# EasyEDA Pro project ProPrj_超市储物柜控制系统_2026-04-29.epro

# Schematic Schematic1
Assembly Variant: Basic; Board Name: Board1; Create Date: 2026-04-28; Page Name: P1; Project Name: 超市储物柜控制系统; Schematic Name: Schematic1; Update Date: 2026-04-28; BladeWidth: 10; Company: 嘉立创EDA; Page Size: A4; RegionStart: 1; ShowBorder: 1; TitleBlock: 1; TitleBlockPosition: 3; Version: V1.0; XRegionCount: 6; YRegionCount: 4
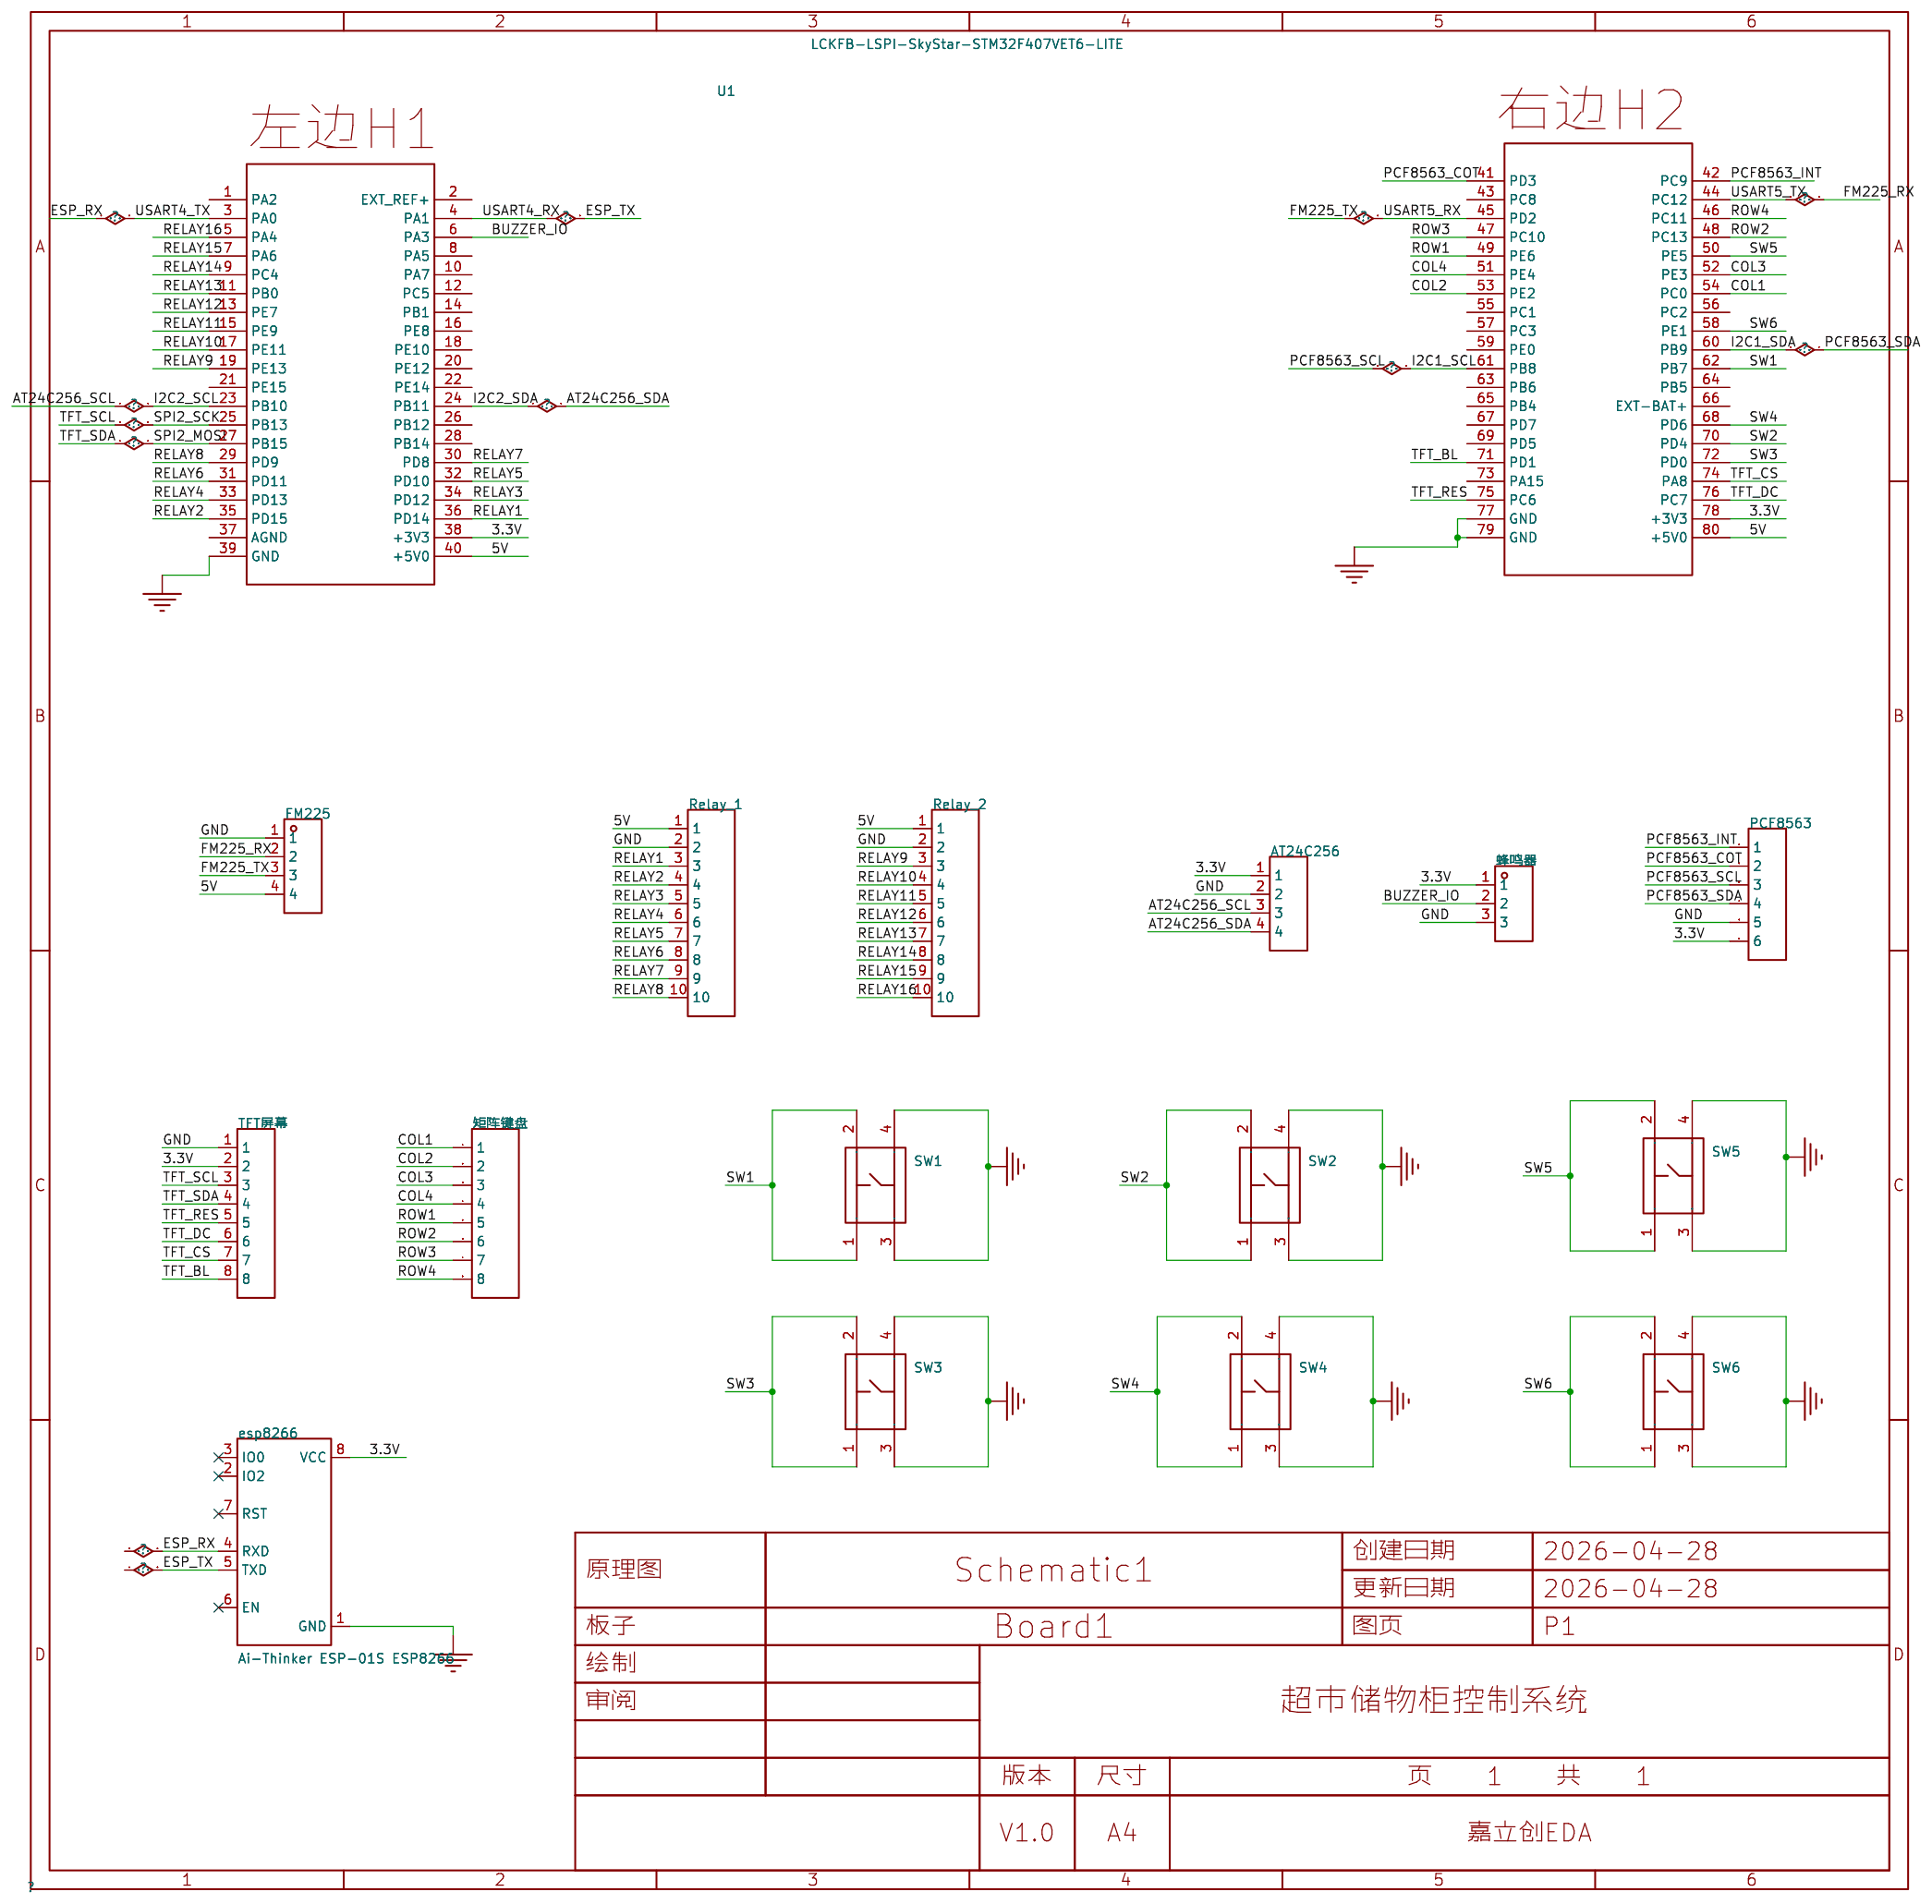
[diagram p0: schematic sheet]

## Parts
AT24C256  -  [HDR-TH_4P-P2.54-V-M]
esp8266  Ai-Thinker ESP-01S ESP8266  [WIFIM-TH_8P-L24.7-W14.4-P2.54]
FM225  -  [HDR-TH_4P-P2.54-V-F]
PCF8563  -  [HDR-TH_6P-P2.54-V-M-1]
Relay_1  -  [HDR-TH_10P-P2.54-V-M-1]
Relay_2  -  [HDR-TH_10P-P2.54-V-M-1]
SW1  K2-1102DP-C4SW-04  [KEY-TH_4P-L6.0-W6.0-P4.50-LS6.50]
SW2  K2-1102DP-C4SW-04  [KEY-TH_4P-L6.0-W6.0-P4.50-LS6.50]
SW3  K2-1102DP-C4SW-04  [KEY-TH_4P-L6.0-W6.0-P4.50-LS6.50]
SW4  K2-1102DP-C4SW-04  [KEY-TH_4P-L6.0-W6.0-P4.50-LS6.50]
SW5  K2-1102DP-C4SW-04  [KEY-TH_4P-L6.0-W6.0-P4.50-LS6.50]
SW6  K2-1102DP-C4SW-04  [KEY-TH_4P-L6.0-W6.0-P4.50-LS6.50]
TFT屏幕  -  [HDR-TH_8P-P2.54-V-F-1]
U1  LCKFB-LSPI-SkyStar-STM32F407VET6-LITE  [COMM-TH_LCKFB-LSPI-SKYSTAR-STM32F407VET6-LITE]
矩阵键盘  -  [HDR-TH_8P-P2.54-V-M]
蜂鸣器  -  [HDR-TH_3P-P2.54-V-M]

## Library data of the parts
AT24C256 = HDR-M_2.54_1x4P: Supplier Part: C492403; Supplier Footprint: 插件
esp8266 = Ai-Thinker ESP-01S ESP8266: Supplier Part: C17606792; Manufacturer: Ai-Thinker(安信可); JLCPCB Part Class: Extended Part; Datasheet: https://item.szlcsc.com/datasheet/Ai-Thinker%2520ESP-01S%2520ESP8266/18736031.html; Supplier: LCSC
FM225 = HDR-F_2.54_1x4P: Supplier Part: C2718488; Supplier Footprint: 插件
PCF8563 = HDR-M_2.54_1x6P: Supplier Part: C37208; Supplier Footprint: 插件
Relay_1 Relay_2 = HDR-M_2.54_1x10P: Supplier Part: C57369; Supplier Footprint: 插件
SW1-SW6 = K2-1102DP-C4SW-04: 电路结构:单刀单掷;按钮形状:圆形按钮;作用力:2.5N;安装方式:直插;开关长度:6mm;开关宽度:6mm;开关高度:5mm;触点电流:50mA;额定电压:12V;带灯:-;工作寿命:10万次;; LCSC Part Name: 轻触按键开关6*6*5; Supplier Part: C110153; Manufacturer: 韩国韩荣; Supplier Footprint: 插件-4P,6x6mm; JLCPCB Part Class: Extended Part; Datasheet: https://item.szlcsc.com/datasheet/K2-1102DP-C4SW-04/111374.html; Supplier: LCSC; Circuit: 单刀单掷; Actuator Style: 圆形按钮; Operating Force: 2.5N; Mounting Type: 直插; Length: 6mm; Width: 6mm; Switch Height: 5mm; Contact Current: 50mA; Voltage Rating: 12V; Life: 10万次; Operating Temperature: -25℃~+85℃
TFT屏幕 = HDR-F_2.54_1x8P: Supplier Part: C27438; Supplier Footprint: 插件
U1 = LCKFB-LSPI-SkyStar-STM32F407VET6-LITE: 单板,不送排针; LCSC Part Name: 立创·天空星开发板-STM32F407VET6-青春版; Supplier Part: C22370035; Manufacturer: 立创开发板; JLCPCB Part Class: Extended Part; Datasheet: https://item.szlcsc.com/datasheet/LCKFB-LSPI-SkyStar-STM32F407VET6-LITE/23849165.html; Supplier: LCSC
矩阵键盘 = HDR-M_2.54_1x8P: Supplier Part: C124381; Supplier Footprint: 插件
蜂鸣器 = HDR-M_2.54_1x3P: Supplier Part: C2937625; Supplier Footprint: 插件

## Nets
3.3V: AT24C256.1 esp8266.8(VCC) PCF8563.6 TFT屏幕.2 U1.38(+3V3) U1.78(+3V3) 蜂鸣器.1
5V: FM225.4 Relay_1.1 Relay_2.1 U1.40(+5V0) U1.80(+5V0)
GND: AT24C256.2 esp8266.1(GND) FM225.1 PCF8563.5 Relay_1.2 Relay_2.2 SW1.3 SW1.4 SW2.3 SW2.4 SW3.3 SW3.4 SW4.3 SW4.4 SW5.3 SW5.4 SW6.3 SW6.4 TFT屏幕.1 U1.39(GND) U1.77(GND) U1.79(GND) 蜂鸣器.3
AT24C256_SCL: AT24C256.3 U1.23(PB10)
AT24C256_SDA: AT24C256.4 U1.24(PB11)
BUZZER_IO: U1.6(PA3) 蜂鸣器.2
COL1: U1.54(PC0) 矩阵键盘.1
COL2: U1.53(PE2) 矩阵键盘.2
COL3: U1.52(PE3) 矩阵键盘.3
COL4: U1.51(PE4) 矩阵键盘.4
ESP_RX: esp8266.4(RXD) U1.3(PA0)
ESP_TX: esp8266.5(TXD) U1.4(PA1)
FM225_RX: FM225.2 U1.44(PC12)
FM225_TX: FM225.3 U1.45(PD2)
I2C1_SCL: PCF8563.3 U1.61(PB8)
I2C1_SDA: PCF8563.4 U1.60(PB9)
PCF8563_COT: PCF8563.2 U1.41(PD3)
PCF8563_INT: PCF8563.1 U1.42(PC9)
RELAY1: Relay_1.3 U1.36(PD14)
RELAY2: Relay_1.4 U1.35(PD15)
RELAY3: Relay_1.5 U1.34(PD12)
RELAY4: Relay_1.6 U1.33(PD13)
RELAY5: Relay_1.7 U1.32(PD10)
RELAY6: Relay_1.8 U1.31(PD11)
RELAY7: Relay_1.9 U1.30(PD8)
RELAY8: Relay_1.10 U1.29(PD9)
RELAY9: Relay_2.3 U1.19(PE13)
RELAY10: Relay_2.4 U1.17(PE11)
RELAY11: Relay_2.5 U1.15(PE9)
RELAY12: Relay_2.6 U1.13(PE7)
RELAY13: Relay_2.7 U1.11(PB0)
RELAY14: Relay_2.8 U1.9(PC4)
RELAY15: Relay_2.9 U1.7(PA6)
RELAY16: Relay_2.10 U1.5(PA4)
ROW1: U1.49(PE6) 矩阵键盘.5
ROW2: U1.48(PC13) 矩阵键盘.6
ROW3: U1.47(PC10) 矩阵键盘.7
ROW4: U1.46(PC11) 矩阵键盘.8
SPI2_MOSI: TFT屏幕.4 U1.27(PB15)
SPI2_SCK: TFT屏幕.3 U1.25(PB13)
SW1: SW1.1 SW1.2 U1.62(PB7)
SW2: SW2.1 SW2.2 U1.70(PD4)
SW3: SW3.1 SW3.2 U1.72(PD0)
SW4: SW4.1 SW4.2 U1.68(PD6)
SW5: SW5.1 SW5.2 U1.50(PE5)
SW6: SW6.1 SW6.2 U1.58(PE1)
TFT_BL: TFT屏幕.8 U1.71(PD1)
TFT_CS: TFT屏幕.7 U1.74(PA8)
TFT_DC: TFT屏幕.6 U1.76(PC7)
TFT_RES: TFT屏幕.5 U1.75(PC6)

Not connected (* = marked no-connect by the designer): esp8266 2(IO2)* 3(IO0)* 6(EN)* 7(RST)*; U1 1(PA2) 2(EXT REF+) 8(PA5) 10(PA7) 12(PC5) 14(PB1) 16(PE8) 18(PE10) 20(PE12) 21(PE15) 22(PE14) 26(PB12) 28(PB14) 37(AGND) 43(PC8) 55(PC1) 56(PC2) 57(PC3) 59(PE0) 63(PB6) 64(PB5) 65(PB4) 66(EXT-BAT+) 67(PD7) 69(PD5) 73(PA15)

# Board PCB1
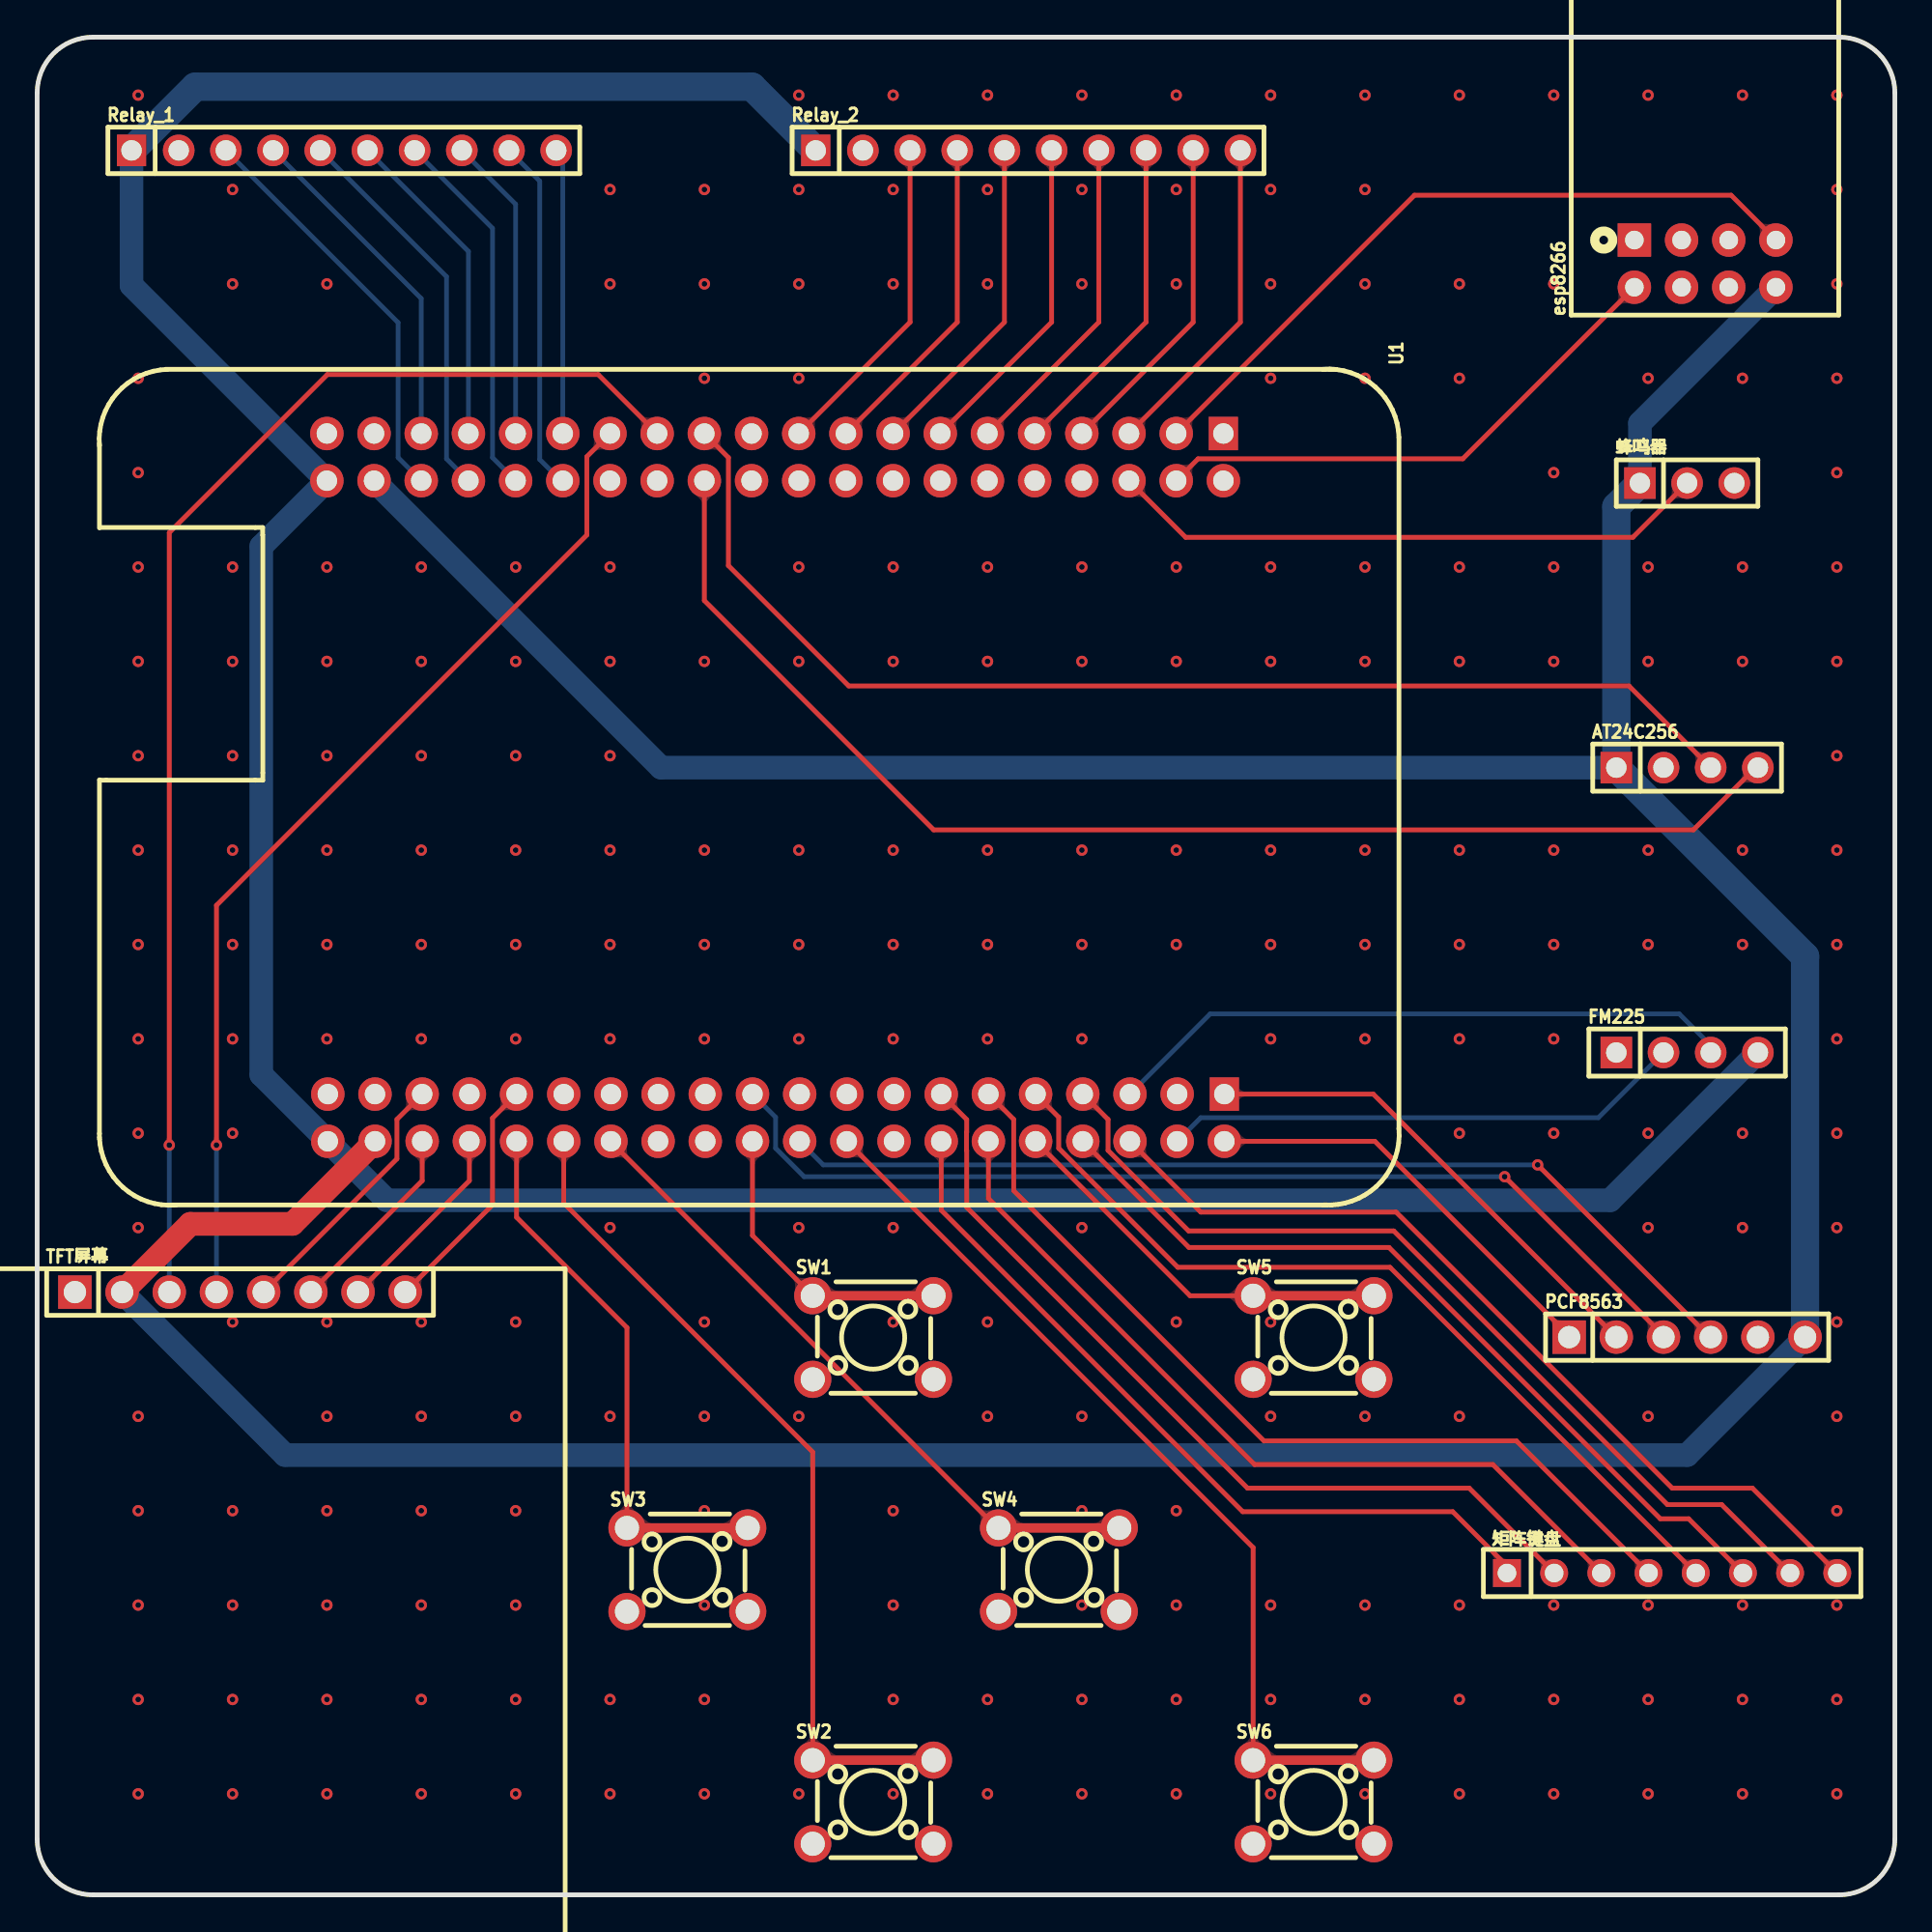
[diagram p1: board, top side]
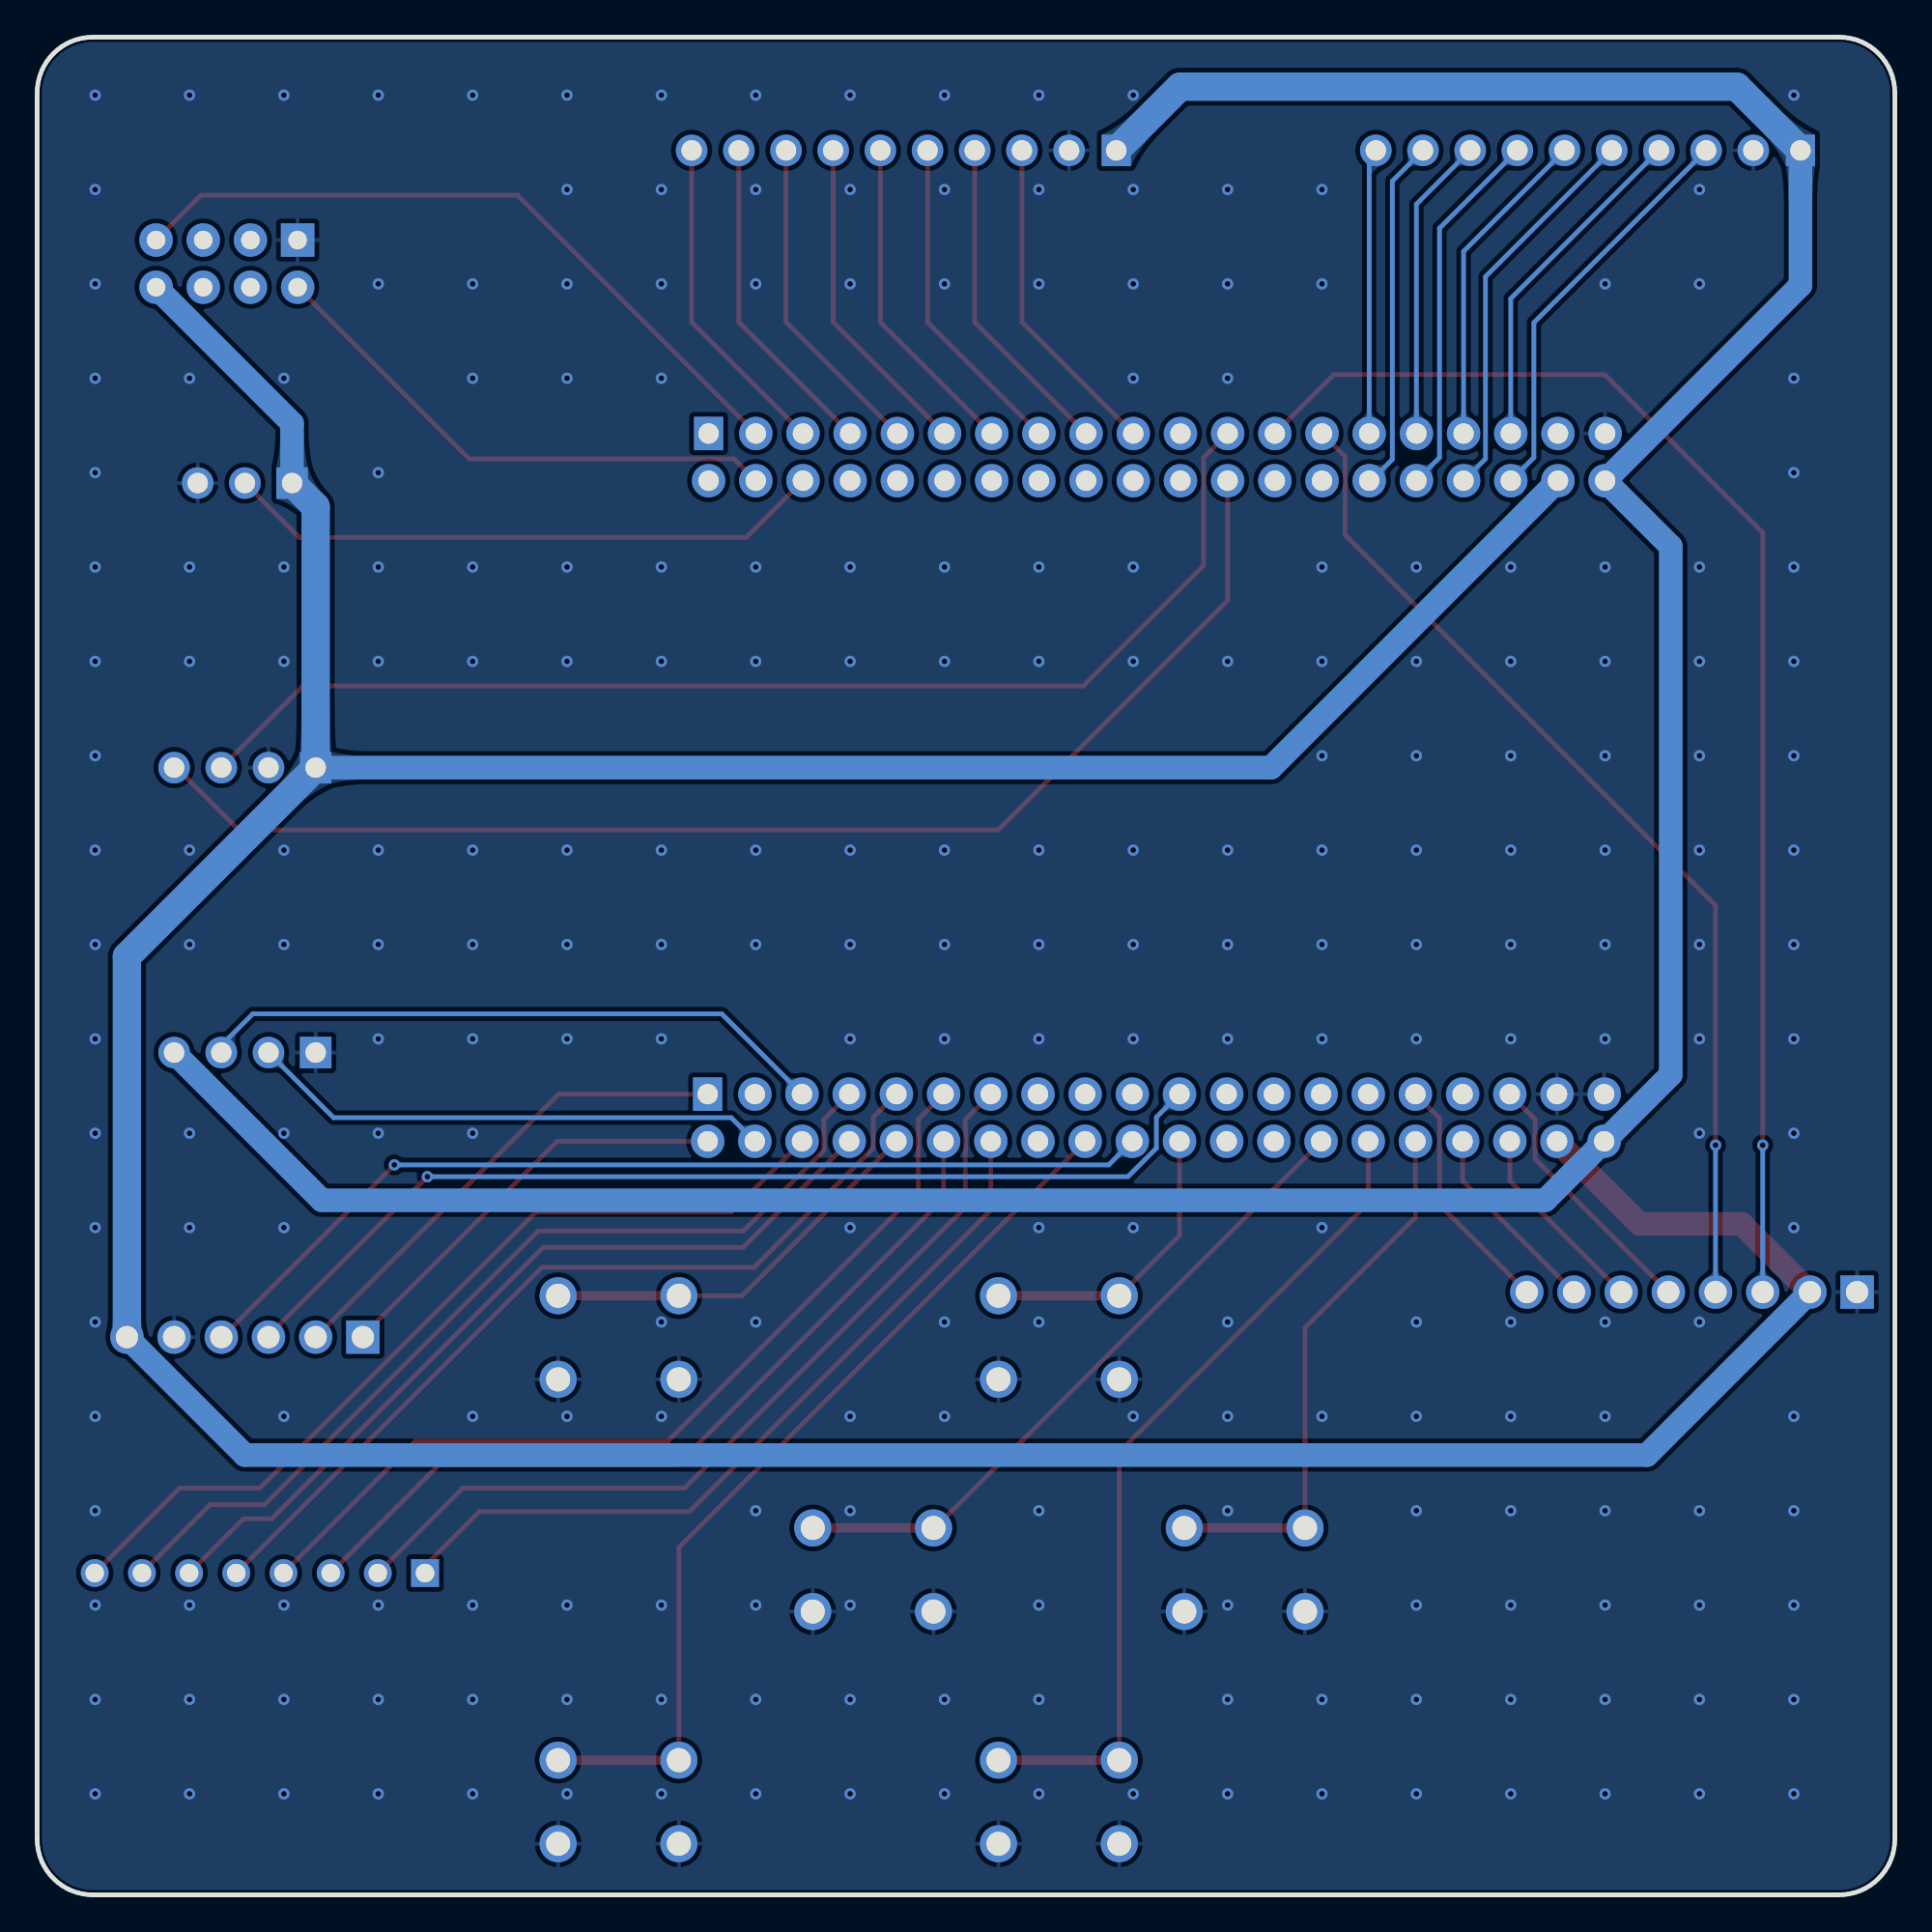
[diagram p2: board, bottom side, seen from below]

Outline 100 x 100 mm; copper layers: Top Layer, Bottom Layer. Coordinates in mm from the lower left corner of the outline.
Outline path: 0,97 0,3 arc(0.88,0.88) 3,0 97,0 arc(99.12,0.88) 100,3 100,97 arc(99.12,99.12) 97,100 3,100 arc(0.88,99.12) 0,97
Stack: Top Layer 0.035mm / Dielectric1 1.51mm FR4 er 4.5 / Bottom Layer 0.035mm

## Design rules (mm)
spacing copperThickness1oz (default): track to track 0.102, other pairs 0.152 to 0.3
spacing copperThickness2oz: track to track 0.203, other pairs 0.152 to 0.3
track width copperThickness1oz (default): min 0.127, default 0.254, max 2.54
track width copperThickness2oz: min 0.203, default 0.254, max 2.54
differential pair differentialPair (default): width min 0.127, default 0.254, max 2.54; gap min 0.152, default 0.152
net GND uses copperRegion

## Placement (name value [footprint] x y rotation side)
AT24C256  -  [HDR-TH_4P-P2.54-V-M]  88.82 60.68 0 top
esp8266  Ai-Thinker ESP-01S ESP8266  [WIFIM-TH_8P-L24.7-W14.4-P2.54]  89.79 87.81 90 top
FM225  -  [HDR-TH_4P-P2.54-V-F]  88.82 45.34 0 top
PCF8563  -  [HDR-TH_6P-P2.54-V-M-1]  88.82 30.02 0 top
Relay_1  -  [HDR-TH_10P-P2.54-V-M-1]  16.51 93.9 0 top
Relay_2  -  [HDR-TH_10P-P2.54-V-M-1]  53.34 93.9 0 top
SW1  K2-1102DP-C4SW-04  [KEY-TH_4P-L6.0-W6.0-P4.50-LS6.50]  45 30 0 top
SW2  K2-1102DP-C4SW-04  [KEY-TH_4P-L6.0-W6.0-P4.50-LS6.50]  45 5 0 top
SW3  K2-1102DP-C4SW-04  [KEY-TH_4P-L6.0-W6.0-P4.50-LS6.50]  35 17.5 0 top
SW4  K2-1102DP-C4SW-04  [KEY-TH_4P-L6.0-W6.0-P4.50-LS6.50]  55 17.5 0 top
SW5  K2-1102DP-C4SW-04  [KEY-TH_4P-L6.0-W6.0-P4.50-LS6.50]  68.71 30 0 top
SW6  K2-1102DP-C4SW-04  [KEY-TH_4P-L6.0-W6.0-P4.50-LS6.50]  68.71 5 0 top
TFT屏幕  -  [HDR-TH_8P-P2.54-V-F-1]  10.92 32.45 0 top
U1  LCKFB-LSPI-SkyStar-STM32F407VET6-LITE  [COMM-TH_LCKFB-LSPI-SKYSTAR-STM32F407VET6-LITE]  39.75 59.61 270 top
矩阵键盘  -  [HDR-TH_8P-P2.54-V-M]  88.01 17.32 0 top
蜂鸣器  -  [HDR-TH_3P-P2.54-V-M]  88.82 76 0 top

## Footprints (pads in the part's own frame, mm; a bottom-side part is the same pattern mirrored in y, then rotated)
COMM-TH_LCKFB-LSPI-SKYSTAR-STM32F407VET6-LITE
  rect 1.8x1.575 hole 1.1: 1(-19.05,24.105) 41(16.51,24.155)
  round 1.8 hole 1.1: 2(-16.51,24.105) 3(-19.05,21.564) 4(-16.51,21.564) 5(-19.05,19.024) 6(-16.51,19.024) 7(-19.05,16.485) 8(-16.51,16.485) 9(-19.05,13.944) 10(-16.51,13.944) 11(-19.05,11.405) 12(-16.51,11.405) 13(-19.05,8.864) 14(-16.51,8.864) 15(-19.05,6.324) 16(-16.51,6.324) 17(-19.05,3.784) 18(-16.51,3.784) 19(-19.05,1.244) 20(-16.51,1.244) 21(-19.05,-1.296) 22(-16.51,-1.296) 23(-19.05,-3.836) 24(-16.51,-3.836) 25(-19.05,-6.375) 26(-16.51,-6.375) 27(-19.05,-8.915) 28(-16.51,-8.915) 29(-19.05,-11.456) 30(-16.51,-11.456) 31(-19.05,-13.995) 32(-16.51,-13.995) 33(-19.05,-16.535) 34(-16.51,-16.535) 35(-19.05,-19.076) 36(-16.51,-19.076) 37(-19.05,-21.616) 38(-16.51,-21.616) 39(-19.05,-24.155) 40(-16.51,-24.155) 42(19.05,24.155) 43(16.51,21.616) 44(19.05,21.616) 45(16.51,19.076) 46(19.05,19.076) 47(16.51,16.535) 48(19.05,16.535) 49(16.51,13.995) 50(19.05,13.995) 51(16.51,11.456) 52(19.05,11.456) 53(16.51,8.915) 54(19.05,8.915) 55(16.51,6.375) 56(19.05,6.375) 57(16.51,3.836) 58(19.05,3.836) 59(16.51,1.296) 60(19.05,1.296) 61(16.51,-1.244) 62(19.05,-1.244) 63(16.51,-3.784) 64(19.05,-3.784) 65(16.51,-6.324) 66(19.05,-6.324) 67(16.51,-8.864) 68(19.05,-8.864) 69(16.51,-11.405) 70(19.05,-11.405) 71(16.51,-13.944) 72(19.05,-13.944) 73(16.51,-16.485) 74(19.05,-16.485) 75(16.51,-19.024) 76(19.05,-19.024) 77(16.51,-21.564) 78(19.05,-21.564) 79(16.51,-24.105) 80(19.05,-24.105)
HDR-TH_3P-P2.54-V-M
  rect 1.7x1.7 hole 1.1: 1(-2.54,0)
  round 1.7 hole 1.1: 2(0,0) 3(2.54,0)
HDR-TH_4P-P2.54-V-F
  rect 1.7x1.7 hole 1.1: 1(-3.81,0)
  round 1.7 hole 1.1: 2(-1.27,0) 3(1.27,0) 4(3.81,0)
HDR-TH_4P-P2.54-V-M
  rect 1.7x1.7 hole 1.1: 1(-3.81,0)
  round 1.7 hole 1.1: 2(-1.27,0) 3(1.27,0) 4(3.81,0)
HDR-TH_6P-P2.54-V-M-1
  rect 1.8x1.8 hole 1.2: 1(-6.35,0)
  round 1.8 hole 1.2: 2(-3.81,0) 3(-1.27,0) 4(1.27,0) 5(3.81,0) 6(6.35,0)
HDR-TH_8P-P2.54-V-F-1
  rect 1.8x1.8 hole 1.2: 1(-8.89,0)
  round 1.8 hole 1.2: 2(-6.35,0) 3(-3.81,0) 4(-1.27,0) 5(1.27,0) 6(3.81,0) 7(6.35,0) 8(8.89,0)
HDR-TH_8P-P2.54-V-M
  rect 1.5x1.5 hole 1: 1(-8.89,0)
  round 1.5 hole 1: 2(-6.35,0) 3(-3.81,0) 4(-1.27,0) 5(1.27,0) 6(3.81,0) 7(6.35,0) 8(8.89,0)
HDR-TH_10P-P2.54-V-M-1
  rect 1.575x1.7 hole 1.1: 1(-11.43,0)
  round 1.7 hole 1.1: 2(-8.89,0) 3(-6.35,0) 4(-3.81,0) 5(-1.27,0) 6(1.27,0) 7(3.81,0) 8(6.35,0) 9(8.89,0) 10(11.43,0)
KEY-TH_4P-L6.0-W6.0-P4.50-LS6.50
  round 2 hole 1.3: 1(-3.25,2.25) 2(3.25,2.25) 3(-3.25,-2.25) 4(3.25,-2.25)
WIFIM-TH_8P-L24.7-W14.4-P2.54
  rect 1.8x1.8 hole 1: 1(1.27,3.81)
  round 1.8 hole 1: 2(1.27,1.27) 3(1.27,-1.27) 4(1.27,-3.81) 5(-1.27,3.81) 6(-1.27,1.27) 7(-1.27,-1.27) 8(-1.27,-3.81)

## Nets
As in the schematic.

Pads without a net: esp8266 2 3 6 7; U1 1 2 8 10 12 14 16 18 20 21 22 26 28 37 43 55 56 57 59 63 64 65 66 67 69 73

## Via types
v1: diameter 0.61, hole 0.305, Top Layer to Bottom Layer, 254 vias

## Routing (per net, layer and track width the routed paths; a pad name or vN(x,y) marks a point on that pad's centre or on a via; arc(x,y) is an arc through that point)
3.3V: length 251.4
  Top Layer w1.27: TFT屏幕.2 8.25,36.12 13.74,36.12 U1.78
  Bottom Layer w1.27: TFT屏幕.2 13.34,23.67 88.82,23.67 PCF8563.6 ; AT24C256.1 33.58,60.68 U1.38 ; esp8266.8 86.28,79.22 蜂鸣器.1
  Bottom Layer w1.524: 蜂鸣器.1 85.01,74.73 AT24C256.1 95.17,50.52 PCF8563.6
5V: length 181.9
  Bottom Layer w1.27: Relay_1.1 5.08,86.64 U1.40 12.06,72.59 12.06,44.15 U1.80 18.82,37.39 84.68,37.39 FM225.4
  Bottom Layer w1.524: Relay_2.1 38.48,97.33 8.51,97.33 Relay_1.1
GND:
  vias: v1(5.44,96.88) v1(5.44,81.64) v1(5.44,76.56) v1(5.44,71.48) v1(5.44,66.4) v1(5.44,61.32) v1(5.44,56.24) v1(5.44,51.16) v1(5.44,46.08) v1(5.44,41) v1(5.44,35.92) v1(5.44,25.76) v1(5.44,20.68) v1(5.44,15.6) v1(5.44,10.52) v1(5.44,5.44) v1(10.52,91.8) v1(10.52,86.72) v1(10.52,71.48) v1(10.52,66.4) v1(10.52,61.32) v1(10.52,56.24) v1(10.52,51.16) v1(10.52,46.08) v1(10.52,41) v1(10.52,30.84) v1(10.52,20.68) v1(10.52,15.6) v1(10.52,10.52) v1(10.52,5.44) v1(15.6,86.72) v1(15.6,71.48) v1(15.6,66.4) v1(15.6,61.32) v1(15.6,56.24) v1(15.6,51.16) v1(15.6,46.08) v1(15.6,30.84) v1(15.6,25.76) v1(15.6,20.68) v1(15.6,15.6) v1(15.6,10.52) v1(15.6,5.44) v1(20.68,71.48) v1(20.68,66.4) v1(20.68,61.32) v1(20.68,56.24) v1(20.68,51.16) v1(20.68,46.08) v1(20.68,30.84) v1(20.68,25.76) v1(20.68,20.68) v1(20.68,15.6) v1(20.68,10.52) v1(20.68,5.44) v1(25.76,71.48) v1(25.76,66.4) v1(25.76,61.32) v1(25.76,56.24) v1(25.76,51.16) v1(25.76,46.08) v1(25.76,30.84) v1(25.76,25.76) v1(25.76,20.68) v1(25.76,15.6) v1(25.76,10.52) v1(25.76,5.44) v1(30.84,91.8) v1(30.84,86.72) v1(30.84,71.48) v1(30.84,66.4) v1(30.84,61.32) v1(30.84,56.24) v1(30.84,51.16) v1(30.84,46.08) v1(30.84,35.92) v1(30.84,25.76) v1(30.84,10.52) v1(30.84,5.44) v1(35.92,91.8) v1(35.92,86.72) v1(35.92,81.64) v1(35.92,66.4) v1(35.92,56.24) v1(35.92,51.16) v1(35.92,46.08) v1(35.92,30.84) v1(35.92,25.76) v1(35.92,20.68) v1(35.92,15.6) v1(35.92,10.52) v1(35.92,5.44) v1(41,96.88) v1(41,91.8) v1(41,86.72) v1(41,81.64) v1(41,71.48) v1(41,66.4) v1(41,56.24) v1(41,51.16) v1(41,46.08) v1(41,35.92) v1(41,25.76) v1(41,5.44) v1(46.08,96.88) v1(46.08,91.8) v1(46.08,86.72) v1(46.08,71.48) v1(46.08,66.4) v1(46.08,56.24) v1(46.08,51.16) v1(46.08,46.08) v1(46.08,35.92) v1(46.08,30.84) v1(46.08,20.68) v1(46.08,15.6) v1(46.08,10.52) v1(46.08,5.44) v1(51.16,96.88) v1(51.16,91.8) v1(51.16,86.72) v1(51.16,71.48) v1(51.16,66.4) v1(51.16,56.24) v1(51.16,51.16) v1(51.16,46.08) v1(51.16,30.84) v1(51.16,25.76) v1(51.16,10.52) v1(51.16,5.44) v1(56.24,96.88) v1(56.24,91.8) v1(56.24,86.72) v1(56.24,71.48) v1(56.24,66.4) v1(56.24,56.24) v1(56.24,51.16) v1(56.24,46.08) v1(56.24,35.92) v1(56.24,25.76) v1(56.24,20.68) v1(56.24,15.6) v1(56.24,10.52) v1(56.24,5.44) v1(61.32,96.88) v1(61.32,91.8) v1(61.32,86.72) v1(61.32,71.48) v1(61.32,66.4) v1(61.32,56.24) v1(61.32,51.16) v1(61.32,30.84) v1(61.32,20.68) v1(61.32,15.6) v1(61.32,10.52) v1(61.32,5.44) v1(66.4,96.88) v1(66.4,91.8) v1(66.4,86.72) v1(66.4,81.64) v1(66.4,71.48) v1(66.4,66.4) v1(66.4,56.24) v1(66.4,51.16) v1(66.4,46.08) v1(66.4,30.84) v1(66.4,25.76) v1(66.4,15.6) v1(66.4,10.52) v1(66.4,5.44) v1(71.48,96.88) v1(71.48,91.8) v1(71.48,86.72) v1(71.48,81.64) v1(71.48,71.48) v1(71.48,66.4) v1(71.48,56.24) v1(71.48,51.16) v1(71.48,46.08) v1(71.48,25.76) v1(71.48,15.6) v1(71.48,10.52) v1(71.48,5.44) v1(76.56,96.88) v1(76.56,86.72) v1(76.56,81.64) v1(76.56,71.48) v1(76.56,66.4) v1(76.56,56.24) v1(76.56,51.16) v1(76.56,46.08) v1(76.56,41) v1(76.56,25.76) v1(76.56,15.6) v1(76.56,10.52) v1(76.56,5.44) v1(81.64,96.88) v1(81.64,86.72) v1(81.64,76.56) v1(81.64,71.48) v1(81.64,66.4) v1(81.64,56.24) v1(81.64,51.16) v1(81.64,46.08) v1(81.64,41) v1(81.64,15.6) v1(81.64,10.52) v1(81.64,5.44) v1(86.72,96.88) v1(86.72,81.64) v1(86.72,71.48) v1(86.72,66.4) v1(86.72,56.24) v1(86.72,51.16) v1(86.72,41) v1(86.72,35.92) v1(86.72,25.76) v1(86.72,15.6) v1(86.72,10.52) v1(86.72,5.44) v1(91.8,96.88) v1(91.8,81.64) v1(91.8,71.48) v1(91.8,66.4) v1(91.8,56.24) v1(91.8,51.16) v1(91.8,41) v1(91.8,35.92) v1(91.8,15.6) v1(91.8,10.52) v1(91.8,5.44) v1(96.88,96.88) v1(96.88,91.8) v1(96.88,86.72) v1(96.88,81.64) v1(96.88,76.56) v1(96.88,71.48) v1(96.88,66.4) v1(96.88,61.32) v1(96.88,56.24) v1(96.88,51.16) v1(96.88,46.08) v1(96.88,41) v1(96.88,35.92) v1(96.88,30.84) v1(96.88,25.76) v1(96.88,20.68) v1(96.88,15.6) v1(96.88,10.52) v1(96.88,5.44)
AT24C256_SCL: length 65
  Top Layer w0.254: AT24C256.3 85.69,65.08 43.69,65.08 37.21,71.55 37.21,77.37 U1.23
AT24C256_SDA: length 69.7
  Top Layer w0.254: U1.24 35.92,69.67 48.26,57.33 89.15,57.33 92.5,60.68 AT24C256.4
BUZZER_IO: length 32.5
  Top Layer w0.254: U1.6 61.82,73.08 85.9,73.08 蜂鸣器.2
COL1: length 42.5
  Top Layer w0.254: U1.54 48.67,36.86 64.9,20.62 76.2,20.62 79.12,17.7 矩阵键盘.1
COL2: length 46.4
  Top Layer w0.254: U1.53 50.04,41.73 50.04,41.06 50.03,41.05 50.03,40.08 50.04,40.06 50.04,37.01 65.15,21.9 77.09,21.9 矩阵键盘.2
COL3: length 44.4
  Top Layer w0.254: U1.52 51.21,37.49 65.53,23.16 78.36,23.16 矩阵键盘.3
COL4: length 48.5
  Top Layer w0.254: 矩阵键盘.4 79.63,24.44 66.04,24.44 52.57,37.91 52.57,41.74 U1.51
ESP_RX: length 38.6
  Top Layer w0.254: U1.3 74.14,91.49 91.19,91.49 esp8266.4
ESP_TX: length 29
  Top Layer w0.254: U1.4 62.49,77.3 76.74,77.3 85.98,86.54
FM225_RX: length 28.2
  Bottom Layer w0.254: U1.44 62.64,41.83 84.04,41.83 FM225.2
FM225_TX: length 34.1
  Bottom Layer w0.254: U1.45 63.14,47.42 88.39,47.42 90.09,45.73 FM225.3
I2C1_SCL: length 55.5
  Top Layer w0.254: v1(78.99,38.66) 87.55,30.11 PCF8563.3
  Bottom Layer w0.254: v1(78.99,38.66) 41.28,38.66 39.75,40.19 39.75,41.86 U1.61
I2C1_SDA: length 53.4
  Top Layer w0.254: v1(80.77,39.29) 90.04,30.02 PCF8563.4
  Bottom Layer w0.254: v1(80.77,39.29) 42.32,39.29 U1.60
PCF8563_COT: length 26.5
  Top Layer w0.254: PCF8563.2 71.93,43.1 U1.41
PCF8563_INT: length 23
  Top Layer w0.254: U1.42 72.01,40.56 82.47,30.11 PCF8563.1
RELAY1: length 22.1
  Bottom Layer w0.254: U1.36 19.43,77.37 19.43,84.63 Relay_1.3
RELAY2: length 18.5
  Bottom Layer w0.254: Relay_1.4 20.68,85.93 U1.35
RELAY3: length 21.1
  Bottom Layer w0.254: U1.34 22.04,77.3 22.04,87.11 Relay_1.5
RELAY4: length 17.5
  Bottom Layer w0.254: U1.33 23.22,88.47 Relay_1.6
RELAY5: length 20
  Bottom Layer w0.254: Relay_1.7 24.51,89.71 24.51,77.37 U1.32
RELAY6: length 16.4
  Bottom Layer w0.254: Relay_1.8 25.76,91.01 U1.31
RELAY7: length 19
  Bottom Layer w0.254: U1.30 28.19,76.12 27.05,77.27 27.05,92.25 Relay_1.9
RELAY8: length 15.4
  Bottom Layer w0.254: Relay_1.10 28.3,93.55 U1.29
RELAY9: length 17.7
  Top Layer w0.254: Relay_2.3 46.99,84.66 U1.19
RELAY10: length 17.7
  Top Layer w0.254: U1.17 49.53,84.66 Relay_2.4
RELAY11: length 17.7
  Top Layer w0.254: Relay_2.5 52.07,84.66 U1.15
RELAY12: length 17.7
  Top Layer w0.254: U1.13 54.61,84.66 Relay_2.6
RELAY13: length 17.7
  Top Layer w0.254: U1.11 57.15,84.66 Relay_2.7
RELAY14: length 17.7
  Top Layer w0.254: Relay_2.8 59.69,84.66 U1.9
RELAY15: length 17.7
  Top Layer w0.254: U1.7 62.23,84.66 Relay_2.9
RELAY16: length 17.7
  Top Layer w0.254: Relay_2.10 64.77,84.66 U1.5
ROW1: length 47.2
  Top Layer w0.254: U1.49 54.99,41.86 54.99,40.19 61.4,33.78 72.82,33.78 矩阵键盘.5
ROW2: length 45.2
  Top Layer w0.254: 矩阵键盘.6 88.9,20.24 87.38,20.24 72.77,34.85 62,34.85 U1.48
ROW3: length 49.7
  Top Layer w0.254: U1.47 57.65,41.74 57.65,40.08 61.99,35.74 73.03,35.74 87.76,21.01 90.68,21.01 矩阵键盘.7
ROW4: length 47.7
  Top Layer w0.254: 矩阵键盘.8 92.33,21.9 88.01,21.9 73.15,36.75 62.64,36.75 U1.46
SPI2_MOSI: length 55
  Top Layer w0.254: U1.27 29.59,77.42 29.59,73.2 9.65,53.26 v1(9.65,40.36)
  Bottom Layer w0.254: v1(9.65,40.36) TFT屏幕.4
SPI2_SCK: length 72
  Top Layer w0.254: U1.25 30.2,81.84 15.62,81.84 7.11,73.33 v1(7.11,40.36)
  Bottom Layer w0.254: v1(7.11,40.36) TFT屏幕.3
SW1: length 16.2
  Top Layer w0.254: U1.62 38.51,35.49 SW1.1
  Top Layer w0.508: SW1.1 SW1.2
SW2: length 45.4
  Top Layer w0.254: U1.70 28.35,37.24 41.75,23.83 SW2.1
  Top Layer w0.508: SW2.1 SW2.2
SW3: length 29.8
  Top Layer w0.254: U1.72 25.81,36.47 31.75,30.53 SW3.1
  Top Layer w0.508: SW3.1 SW3.2
SW4: length 35.9
  Top Layer w0.254: U1.68 30.89,40.54 51.68,19.75
  Top Layer w0.508: SW4.1 SW4.2
SW5: length 21.7
  Top Layer w0.254: U1.50 62.06,32.25 SW5.1
  Top Layer w0.508: SW5.1 SW5.2
SW6: length 48.9
  Top Layer w0.254: SW6.1 65.46,18.69 U1.58
  Top Layer w0.508: SW6.1 SW6.2
TFT_BL: length 13.1
  Top Layer w0.254: TFT屏幕.8 24.51,37.14 24.51,41.81 U1.71
TFT_CS: length 10.6
  Top Layer w0.254: TFT屏幕.7 23.27,38.44 U1.74
TFT_DC: length 10.6
  Top Layer w0.254: TFT屏幕.6 20.73,38.44 U1.76
TFT_RES: length 14.2
  Top Layer w0.254: TFT屏幕.5 19.37,39.62 19.37,41.74 U1.75

## Copper pours and planes (outline as drawn; the poured copper is in the pictures)
GND on Top Layer: -43.69,113.46 172.47,113.46 172.47,-35.13 -43.69,-35.13
GND on Bottom Layer: -30.1,117.27 142.49,117.27 142.49,-23.32 -30.1,-23.32

Small or netless copper shapes (teardrops, artwork), in the pictures only: 88 on Top Layer, 46 on Bottom Layer
